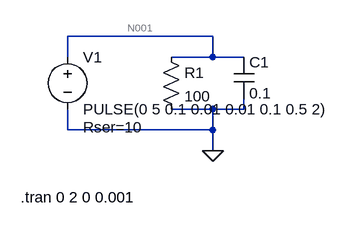
[diagram p0: schematic rc_network.asc]
rc_network.asc, the LTspice schematic file:
Version 4
SHEET 1 880 680
WIRE 272 80 48 80
WIRE 48 112 48 80
WIRE 272 112 272 80
WIRE 272 112 208 112
WIRE 320 112 272 112
WIRE 272 192 208 192
WIRE 320 192 320 176
WIRE 320 192 272 192
WIRE 48 224 48 192
WIRE 272 224 272 192
WIRE 272 224 48 224
WIRE 272 256 272 224
FLAG 272 256 0
SYMBOL voltage 48 96 R0
WINDOW 123 0 0 Left 2
WINDOW 39 24 124 Left 2
SYMATTR InstName V1
SYMATTR Value PULSE(0 5 0.1 0.01 0.01 0.1 0.5 2)
SYMATTR SpiceLine Rser=10
SYMBOL res 192 96 R0
SYMATTR InstName R1
SYMATTR Value 100
SYMATTR SpiceLine tol=0.05
SYMBOL cap 304 112 R0
SYMATTR InstName C1
SYMATTR Value 0.1
TEXT -24 328 Left 2 !.tran 0 2 0 0.001

The netlist it stands for:
* rc_network.asc
V1 N001 0 PULSE(0 5 0.1 0.01 0.01 0.1 0.5 2) Rser=10
R1 N001 0 100 tol=0.05
C1 N001 0 0.1
.tran 0 2 0 0.001
.backanno
.end

* Results of the author's LTspice run, read from the files saved beside the schematic
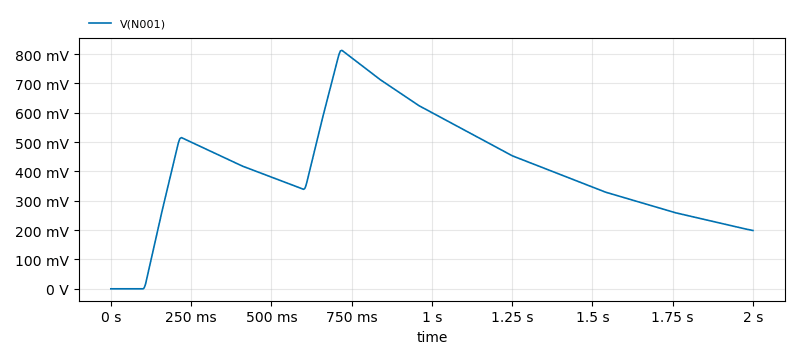
[diagram p1: Transient Analysis of rc_network.asc, plotted from the saved traces]
* Transient Analysis, 1 run:
*   V(N001): min 0 V, max 812.4 mV, average 411.4 mV, rms 454.5 mV, last 198.7 mV